# Altium project DeejBusinessCard.PrjPCB
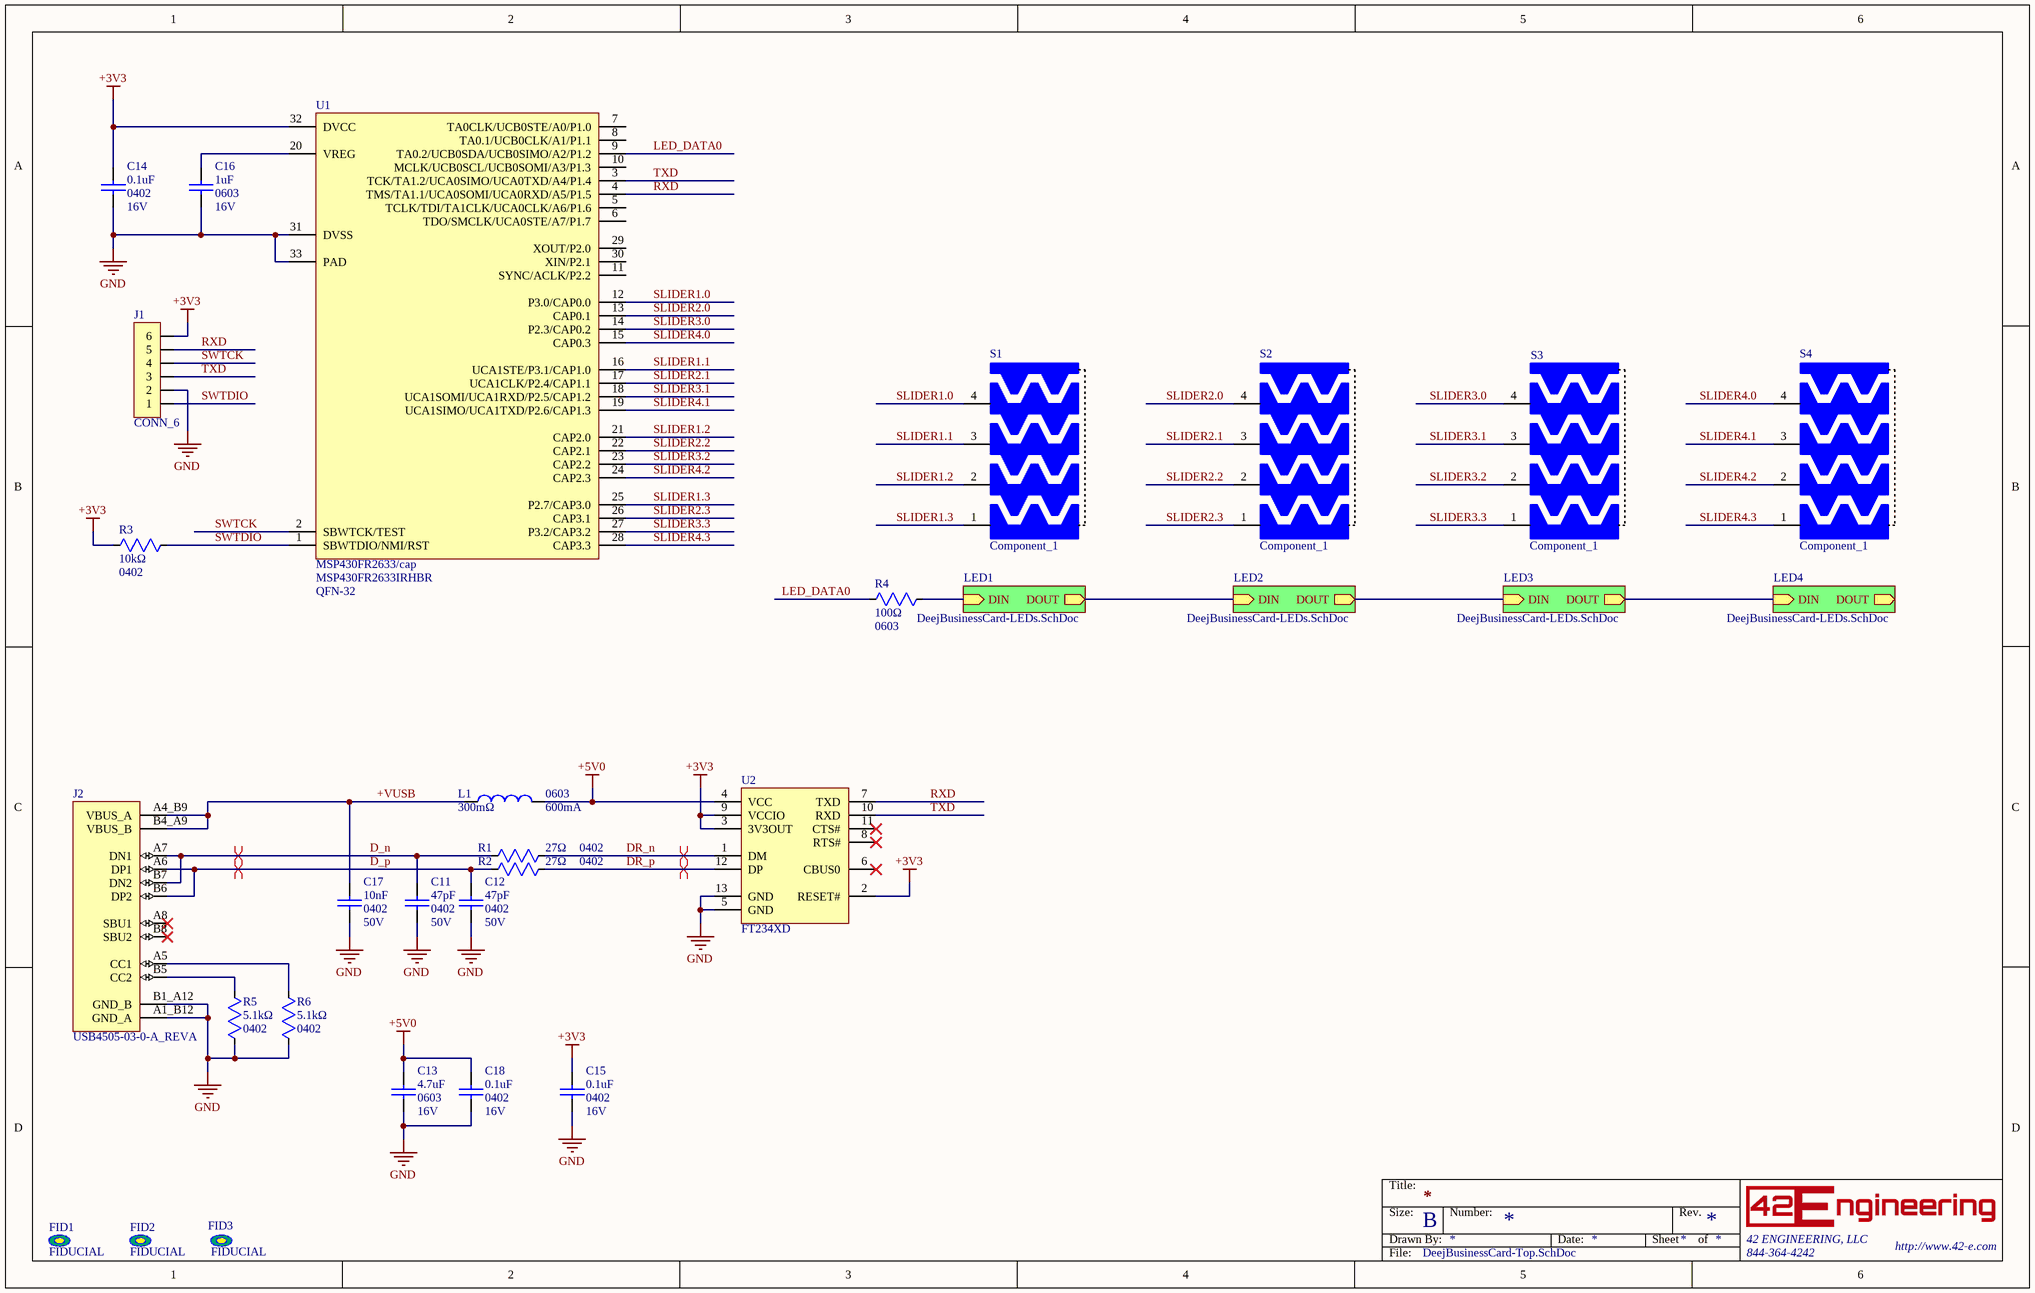
[diagram p0: DeejBusinessCard-Top.SchDoc]
Date_Code: 20240411; Part_Number: 02; Project_Name: DeejBoard; Project_Number: 112; PWB_Drawing_Number: DeejBoard; PWB_Revision: 02
2 sheets, 106 parts. Net scope: hierarchical (ports join the sheet entries above them; power ports are global).
Board files: DeejBusinessCard.PcbDoc, DeejBusinessCarda.PcbDoc
Sheets:
  DeejBusinessCard-Top.SchDoc
    LED1 = DeejBusinessCard-LEDs.SchDoc
    LED2 = DeejBusinessCard-LEDs.SchDoc
    LED3 = DeejBusinessCard-LEDs.SchDoc
    LED4 = DeejBusinessCard-LEDs.SchDoc

## Sheet DeejBusinessCard-Top.SchDoc
size B

### Parts
C11  value 47pF  Case/Package: 0402  Voltage: 50V  [CAPC1005L]  (hidden comment: Capacitor_Ceramic)
C12  value 47pF  Case/Package: 0402  Voltage: 50V  [CAPC1005L]  (hidden comment: Capacitor_Ceramic)
C13  value 4.7uF  Case/Package: 0603  Voltage: 16V  [CAPC1608N]  (hidden comment: Capacitor_Ceramic)
C14  value 0.1uF  Case/Package: 0402  Voltage: 16V  [CAPC1005L]  (hidden comment: Capacitor_Ceramic)
C15  value 0.1uF  Case/Package: 0402  Voltage: 16V  [CAPC1005L]  (hidden comment: Capacitor_Ceramic)
C16  value 1uF  Case/Package: 0603  Voltage: 16V  [CAPC1608N]  (hidden comment: Capacitor_Ceramic)
C17  value 10nF  Case/Package: 0402  Voltage: 50V  [CAPC1005L]  (hidden comment: Capacitor_Ceramic)
C18  value 0.1uF  Case/Package: 0402  Voltage: 16V  [CAPC1005L]  (hidden comment: Capacitor_Ceramic)
FID1  FIDUCIAL  [FIDUCIAL_1mm]  (no BOM)
FID2  FIDUCIAL  [FIDUCIAL_1mm]  (no BOM)
FID3  FIDUCIAL  [FIDUCIAL_1mm]  (no BOM)
J1  CONN_6  [HDR - TC2030-IDC-NL-FP]
J2  USB4505-03-0-A_REVA  [GCT_USB4505-03-0-A_REVA]
L1  value 300mΩ  Case/Package: 0603  Current: 600mA  [RESC1608N]  (hidden comment: Inductor)
R1  value 27Ω  Case/Package: 0402  [RESC1005L]  (hidden comment: Resistor)
R2  value 27Ω  Case/Package: 0402  [RESC1005L]  (hidden comment: Resistor)
R3  value 10kΩ  Case/Package: 0402  [RESC1005L]  (hidden comment: Resistor)
R4  value 100Ω  Case/Package: 0603  [RESC1608N]  (hidden comment: Resistor)
R5  value 5.1kΩ  Case/Package: 0402  [RESC1005L]  (hidden comment: Resistor)
R6  value 5.1kΩ  Case/Package: 0402  [RESC1005L]  (hidden comment: Resistor)
S1  Component_1  [SLIDER-4-38-13]
S2  Component_1  [SLIDER-4-38-13]
S3  Component_1  [SLIDER-4-38-13]
S4  Component_1  [SLIDER-4-38-13]
U1  MSP430FR2633/cap  Manufacturer Part Number 1: MSP430FR2633IRHBR  Case/Package: QFN-32  [QFN50P500X500X100_HS-33N]
U2  FT234XD  [SON45P300X80_HS-13N]

### Sub-sheets
LED1 = DeejBusinessCard-LEDs.SchDoc: DIN (in), DOUT (out)
LED2 = DeejBusinessCard-LEDs.SchDoc: DIN (in), DOUT (out)
LED3 = DeejBusinessCard-LEDs.SchDoc: DIN (in), DOUT (out)
LED4 = DeejBusinessCard-LEDs.SchDoc: DIN (in), DOUT (out)

### Nets
+3V3: C14.1 C15.1 J1.6 R3.2 U1.32(DVCC) U2.2(RESET#) U2.3(3V3OUT) U2.9(VCCIO)
+5V0: C13.2 C18.1 L1.2(Pri-) U2.4(VCC)
GND: C11.1 C12.1 C13.1 C14.2 C15.2 C16.1 C17.1 C18.2 J1.2 J2.A1_B12(GND_A) J2.B1_A12(GND_B) R5.1 R6.1 U1.31(DVSS) U1.33(PAD) U2.5(GND) U2.13(GND)
+VUSB: C17.2 J2.A4_B9(VBUS_A) J2.B4_A9(VBUS_B) L1.1(Pri+)
D_n: C11.2 J2.A7(DN1) J2.B7(DN2) R1.1
D_p: C12.2 J2.A6(DP1) J2.B6(DP2) R2.1
DR_n: R1.2 U2.1(DM)
DR_p: R2.2 U2.12(DP)
LED_DATA0: R4.1 U1.9(TA0.2/UCB0SDA/UCB0SIMO/A2/P1.2)
RXD: J1.5 U1.4(TMS/TA1.1/UCA0SOMI/UCA0RXD/A5/P1.5) U2.7(TXD)
SLIDER1.0: S1.4 U1.12(P3.0/CAP0.0)
SLIDER1.1: S1.3 U1.16(UCA1STE/P3.1/CAP1.0)
SLIDER1.2: S1.2 U1.21(CAP2.0)
SLIDER1.3: S1.1 U1.25(P2.7/CAP3.0)
SLIDER2.0: S2.4 U1.13(CAP0.1)
SLIDER2.1: S2.3 U1.17(UCA1CLK/P2.4/CAP1.1)
SLIDER2.2: S2.2 U1.22(CAP2.1)
SLIDER2.3: S2.1 U1.26(CAP3.1)
SLIDER3.0: S3.4 U1.14(P2.3/CAP0.2)
SLIDER3.1: S3.3 U1.18(UCA1SOMI/UCA1RXD/P2.5/CAP1.2)
SLIDER3.2: S3.2 U1.23(CAP2.2)
SLIDER3.3: S3.1 U1.27(P3.2/CAP3.2)
SLIDER4.0: S4.4 U1.15(CAP0.3)
SLIDER4.1: S4.3 U1.19(UCA1SIMO/UCA1TXD/P2.6/CAP1.3)
SLIDER4.2: S4.2 U1.24(CAP2.3)
SLIDER4.3: S4.1 U1.28(CAP3.3)
SWTCK: J1.4 U1.2(SBWTCK/TEST)
SWTDIO: J1.1 R3.1 U1.1(SBWTDIO/NMI/RST)
TXD: J1.3 U1.3(TCK/TA1.2/UCA0SIMO/UCA0TXD/A4/P1.4) U2.10(RXD)
NetC16_2: C16.2 U1.20(VREG)
NetJ2_A5: J2.A5(CC1) R6.2
NetJ2_B5: J2.B5(CC2) R5.2
NetLED1D1_1: R4.2 ; sheet LED1/DIN
NetLED1D10_3: sheet LED1/DOUT, sheet LED2/DIN
NetLED2D10_3: sheet LED2/DOUT, sheet LED3/DIN
NetLED3D10_3: sheet LED3/DOUT, sheet LED4/DIN

Not connected (* = marked no-connect by the designer): J2 A8(SBU1)* B8(SBU2)*; U1 5(TCLK/TDI/TA1CLK/UCA0CLK/A6/P1.6) 6(TDO/SMCLK/UCA0STE/A7/P1.7) 7(TA0CLK/UCB0STE/A0/P1.0) 8(TA0.1/UCB0CLK/A1/P1.1) 10(MCLK/UCB0SCL/UCB0SOMI/A3/P1.3) 11(SYNC/ACLK/P2.2) 29(XOUT/P2.0) 30(XIN/P2.1); U2 6(CBUS0)* 8(RTS#)* 11(CTS#)*

### Layout directives
differential pair: D_n, D_p, DR_n, DR_p

### Notes on the sheet
- Title:
- Size:
- Drawn By:
- B
- Number:
- Date:
- Sheet
- Rev.
- of
- 42 ENGINEERING, LLC
- File:
- 844-364-4242
- http://www.42-e.com

### Library data of the parts
C11 C12 = CL05C470JB5NNNC: CAP CER 47PF 50V C0G/NP0 0402; Manufacturer 1: Samsung Electro-Mechanics; Part Number: CL05C470JB5NNNC; Supplier Part Number 1: 1276-1699-1-ND; Manufacturer Part Number 1: CL05C470JB5NNNC
C13 = GRM188Z71C475KE21J: CAP CER 4.7UF 16V X7R 0603; Manufacturer 1: Murata; Part Number: GRM188Z71C475KE21J; Supplier 1: Digi-Key; Supplier Part Number 1: 490-GRM188Z71C475KE21JCT-ND; Manufacturer Part Number 1: GRM188Z71C475KE21J
C14 C15 C18 = CC0402KRX7R7BB104: CAP CER 0.1UF 16V X7R 0402; Manufacturer 1: Yageo; Part Number: CC0402KRX7R7BB104; Supplier Part Number 1: 311-1338-1-ND; Manufacturer Part Number 1: CC0402KRX7R7BB104
C16 = CC0603JRX7R7BB105: CAP CER 1UF 16V X7R 0603; Manufacturer 1: Yageo; Part Number: CC0603JRX7R7BB105; Supplier 1: Digi-Key; Supplier Part Number 1: 311-3485-1-ND; Manufacturer Part Number 1: CC0603JRX7R7BB105
C17 = CC0402JRX7R9BB103: CAP CER 10000PF 50V X7R 0402; Manufacturer 1: Yageo; Part Number: CC0402JRX7R9BB103; Supplier Part Number 1: 311-3339-1-ND; Manufacturer Part Number 1: CC0402JRX7R9BB103
FID1-FID3 = FIDUCIAL: 1MM Fiducial
J1 = Header GENERIC 6pin POGO: Part Number: Header GENERIC 6pin POGO
J2 = USB4505-03-0-A_REVA: USB-C (USB TYPE-C) USB 2.0 Receptacle Connector 24 (16+8 Dummy) Position Board Edge, Cutout; Surface Mount; Through Hole, Right Angle; MF: Global Connector Technology; Price: None; SnapEDA_Link: https://www.snapeda.com/parts/USB4505-03-0-A/Global+Connector+Technology/view-part/?ref=snap; Purchase-URL: https://pricing.snapeda.com/search/part/USB4505-03-0-A/?ref=eda; MP: USB4505-03-0-A; Value: *; Availability: In Stock; Package: None; Check_prices: https://www.snapeda.com/parts/USB4505-03-0-A/Global+Connector+Technology/view-part/?ref=eda
L1 = 742792662: FERRITE BEAD 1K OHM 0603 1LN; Manufacturer 1: Würth Elektronik; Part Number: 742792662; Manufacturer Part Number 1: 742792662; Supplier 1: Digi-Key
R1 R2 = RES0402F27R0: Resistor, 27Ω, 1%, 0.05W, 0402; Manufacturer 1: Yageo; Manufacturer Part Number 1: RC0402FR-0727RL; Part Number: RES0402F27R0
R3 = RES0402F10K0: Resistor, 10kΩ, 1%, 0.05W, 0402; Manufacturer 1: Yageo; Manufacturer Part Number 1: RC0402FR-0710KL; Part Number: RES0402F10K0
R4 = RES0603F100R: Resistor, 100Ω, 1%, 0.1W, 0603; Manufacturer 1: Yageo; Manufacturer Part Number 1: RC0603FR-07100RL; Part Number: RES0603F100R
R5 R6 = RES0402F5K10: Resistor, 5.1kΩ, 1%, 0.05W, 0402; Manufacturer 1: Yageo; Manufacturer Part Number 1: RC0402FR-075K1L; Part Number: RES0402F5K10
U1 = MSP430FR2633: IC MCU 16BIT 15.5KB FRAM 32VQFN; Manufacturer 1: Texas Instruments; Part Number: MSP430FR2633; Supplier 1: Digi-Key; Supplier Part Number 1: 296-48937-1-ND
U2 = FT234XD: IC USB SERIAL BASIC UART 12DFN

## Sheet DeejBusinessCard-LEDs.SchDoc
size B
Used 4 times, as channels LED1, LED2, LED3, LED4. Parts and nets are listed once, with the designators drawn on the sheet.
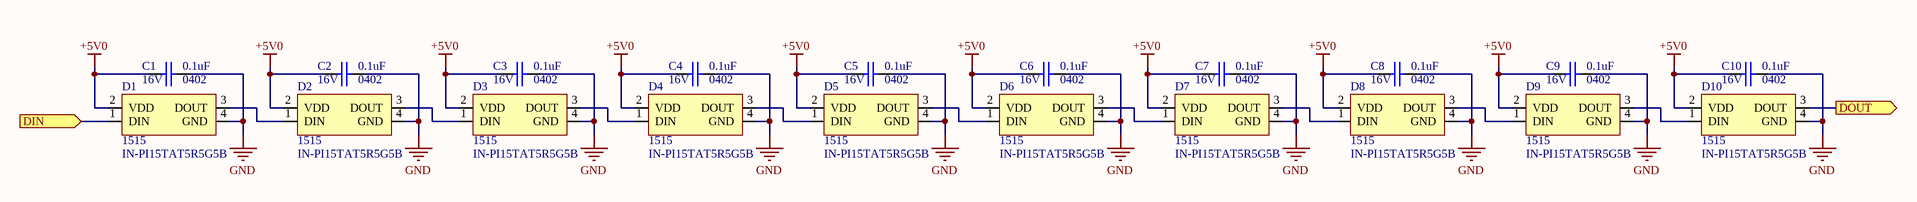
[diagram p1: DeejBusinessCard-LEDs.SchDoc]

### Parts
C1  value 0.1uF  Case/Package: 0402  Voltage: 16V  [CAPC1005L]  (hidden comment: Capacitor_Ceramic)
C2  value 0.1uF  Case/Package: 0402  Voltage: 16V  [CAPC1005L]  (hidden comment: Capacitor_Ceramic)
C3  value 0.1uF  Case/Package: 0402  Voltage: 16V  [CAPC1005L]  (hidden comment: Capacitor_Ceramic)
C4  value 0.1uF  Case/Package: 0402  Voltage: 16V  [CAPC1005L]  (hidden comment: Capacitor_Ceramic)
C5  value 0.1uF  Case/Package: 0402  Voltage: 16V  [CAPC1005L]  (hidden comment: Capacitor_Ceramic)
C6  value 0.1uF  Case/Package: 0402  Voltage: 16V  [CAPC1005L]  (hidden comment: Capacitor_Ceramic)
C7  value 0.1uF  Case/Package: 0402  Voltage: 16V  [CAPC1005L]  (hidden comment: Capacitor_Ceramic)
C8  value 0.1uF  Case/Package: 0402  Voltage: 16V  [CAPC1005L]  (hidden comment: Capacitor_Ceramic)
C9  value 0.1uF  Case/Package: 0402  Voltage: 16V  [CAPC1005L]  (hidden comment: Capacitor_Ceramic)
C10  value 0.1uF  Case/Package: 0402  Voltage: 16V  [CAPC1005L]  (hidden comment: Capacitor_Ceramic)
D1  PCB Footprint: 1515  [IN-PI15TAT5R5G5B]  (hidden comment: IN-PI15TAT5R5G5B)
D2  PCB Footprint: 1515  [IN-PI15TAT5R5G5B]  (hidden comment: IN-PI15TAT5R5G5B)
D3  PCB Footprint: 1515  [IN-PI15TAT5R5G5B]  (hidden comment: IN-PI15TAT5R5G5B)
D4  PCB Footprint: 1515  [IN-PI15TAT5R5G5B]  (hidden comment: IN-PI15TAT5R5G5B)
D5  PCB Footprint: 1515  [IN-PI15TAT5R5G5B]  (hidden comment: IN-PI15TAT5R5G5B)
D6  PCB Footprint: 1515  [IN-PI15TAT5R5G5B]  (hidden comment: IN-PI15TAT5R5G5B)
D7  PCB Footprint: 1515  [IN-PI15TAT5R5G5B]  (hidden comment: IN-PI15TAT5R5G5B)
D8  PCB Footprint: 1515  [IN-PI15TAT5R5G5B]  (hidden comment: IN-PI15TAT5R5G5B)
D9  PCB Footprint: 1515  [IN-PI15TAT5R5G5B]  (hidden comment: IN-PI15TAT5R5G5B)
D10  PCB Footprint: 1515  [IN-PI15TAT5R5G5B]  (hidden comment: IN-PI15TAT5R5G5B)

### Ports
DIN (in), DOUT (out)

### Nets
+5V0: C1.2 C2.2 C3.2 C4.2 C5.2 C6.2 C7.2 C8.2 C9.2 C10.2 D1.2(VDD) D2.2(VDD) D3.2(VDD) D4.2(VDD) D5.2(VDD) D6.2(VDD) D7.2(VDD) D8.2(VDD) D9.2(VDD) D10.2(VDD)
GND: C1.1 C2.1 C3.1 C4.1 C5.1 C6.1 C7.1 C8.1 C9.1 C10.1 D1.4(GND) D2.4(GND) D3.4(GND) D4.4(GND) D5.4(GND) D6.4(GND) D7.4(GND) D8.4(GND) D9.4(GND) D10.4(GND)
DIN: D1.1(DIN) ; port DIN
DOUT: D10.3(DOUT) ; port DOUT
NetD1_3: D1.3(DOUT) D2.1(DIN)
NetD2_3: D2.3(DOUT) D3.1(DIN)
NetD3_3: D3.3(DOUT) D4.1(DIN)
NetD4_3: D4.3(DOUT) D5.1(DIN)
NetD5_3: D5.3(DOUT) D6.1(DIN)
NetD6_3: D6.3(DOUT) D7.1(DIN)
NetD7_3: D7.3(DOUT) D8.1(DIN)
NetD8_3: D8.3(DOUT) D9.1(DIN)
NetD9_3: D9.3(DOUT) D10.1(DIN)

### Channels
LED1: designators C1=LED1C1 C2=LED1C2 C3=LED1C3 C4=LED1C4 C5=LED1C5 C6=LED1C6 C7=LED1C7 C8=LED1C8 C9=LED1C9 C10=LED1C10 D1=LED1D1 D2=LED1D2 D3=LED1D3 D4=LED1D4 D5=LED1D5 D6=LED1D6 D7=LED1D7 D8=LED1D8 D9=LED1D9 D10=LED1D10; ports DIN=NetLED1D1_1 DOUT=NetLED1D10_3
LED2: designators C1=LED2C1 C2=LED2C2 C3=LED2C3 C4=LED2C4 C5=LED2C5 C6=LED2C6 C7=LED2C7 C8=LED2C8 C9=LED2C9 C10=LED2C10 D1=LED2D1 D2=LED2D2 D3=LED2D3 D4=LED2D4 D5=LED2D5 D6=LED2D6 D7=LED2D7 D8=LED2D8 D9=LED2D9 D10=LED2D10; ports DIN=NetLED1D10_3 DOUT=NetLED2D10_3
LED3: designators C1=LED3C1 C2=LED3C2 C3=LED3C3 C4=LED3C4 C5=LED3C5 C6=LED3C6 C7=LED3C7 C8=LED3C8 C9=LED3C9 C10=LED3C10 D1=LED3D1 D2=LED3D2 D3=LED3D3 D4=LED3D4 D5=LED3D5 D6=LED3D6 D7=LED3D7 D8=LED3D8 D9=LED3D9 D10=LED3D10; ports DIN=NetLED2D10_3 DOUT=NetLED3D10_3
LED4: designators C1=LED4C1 C2=LED4C2 C3=LED4C3 C4=LED4C4 C5=LED4C5 C6=LED4C6 C7=LED4C7 C8=LED4C8 C9=LED4C9 C10=LED4C10 D1=LED4D1 D2=LED4D2 D3=LED4D3 D4=LED4D4 D5=LED4D5 D6=LED4D6 D7=LED4D7 D8=LED4D8 D9=LED4D9 D10=LED4D10; ports DIN=NetLED3D10_3 DOUT=NetLED4D10_3

### Notes on the sheet
- Title:
- Size:
- Drawn By:
- B
- Number:
- Date:
- Sheet
- Rev.
- of
- 42 ENGINEERING, LLC
- File:
- 844-364-4242
- http://www.42-e.com

### Library data of the parts
C1-C10 = CC0402KRX7R7BB104: as C14 on sheet DeejBusinessCard-Top; Part Number: CC0402KRX7R7BB104; Supplier Part Number 1: 311-1338-1-ND; Manufacturer Part Number 1: CC0402KRX7R7BB104
D1-D10 = IN-PI15TAT5R5G5B: Addressable Lighting - 1 LED Discrete Red, Green, Blue (RGB) 1.50mm L x 1.50mm W; Manufacturer: Inolux; Unit: EA; RoHS: Yes; Supplier 1: Digikey; Supplier Part Number 1: 1830-IN-PI15TAT5R5G5BCT-ND; Part Number: IN-PI15TAT5R5G5B

## Nets that join several sheets
+5V0: DeejBusinessCard-Top (C13.2 C18.1 L1.2 U2.4), LED1 (20 pins), LED2 (20 pins), LED3 (20 pins), LED4 (20 pins)
GND: DeejBusinessCard-Top (17 pins), LED1 (20 pins), LED2 (20 pins), LED3 (20 pins), LED4 (20 pins)
NetLED1D1_1: DeejBusinessCard-Top (R4.2), LED1 (LED1D1.1)
NetLED1D10_3: LED1 (LED1D10.3), LED2 (LED2D1.1)
NetLED2D10_3: LED2 (LED2D10.3), LED3 (LED3D1.1)
NetLED3D10_3: LED3 (LED3D10.3), LED4 (LED4D1.1)